# EAGLE design buttons (EAGLE 6.5.0)
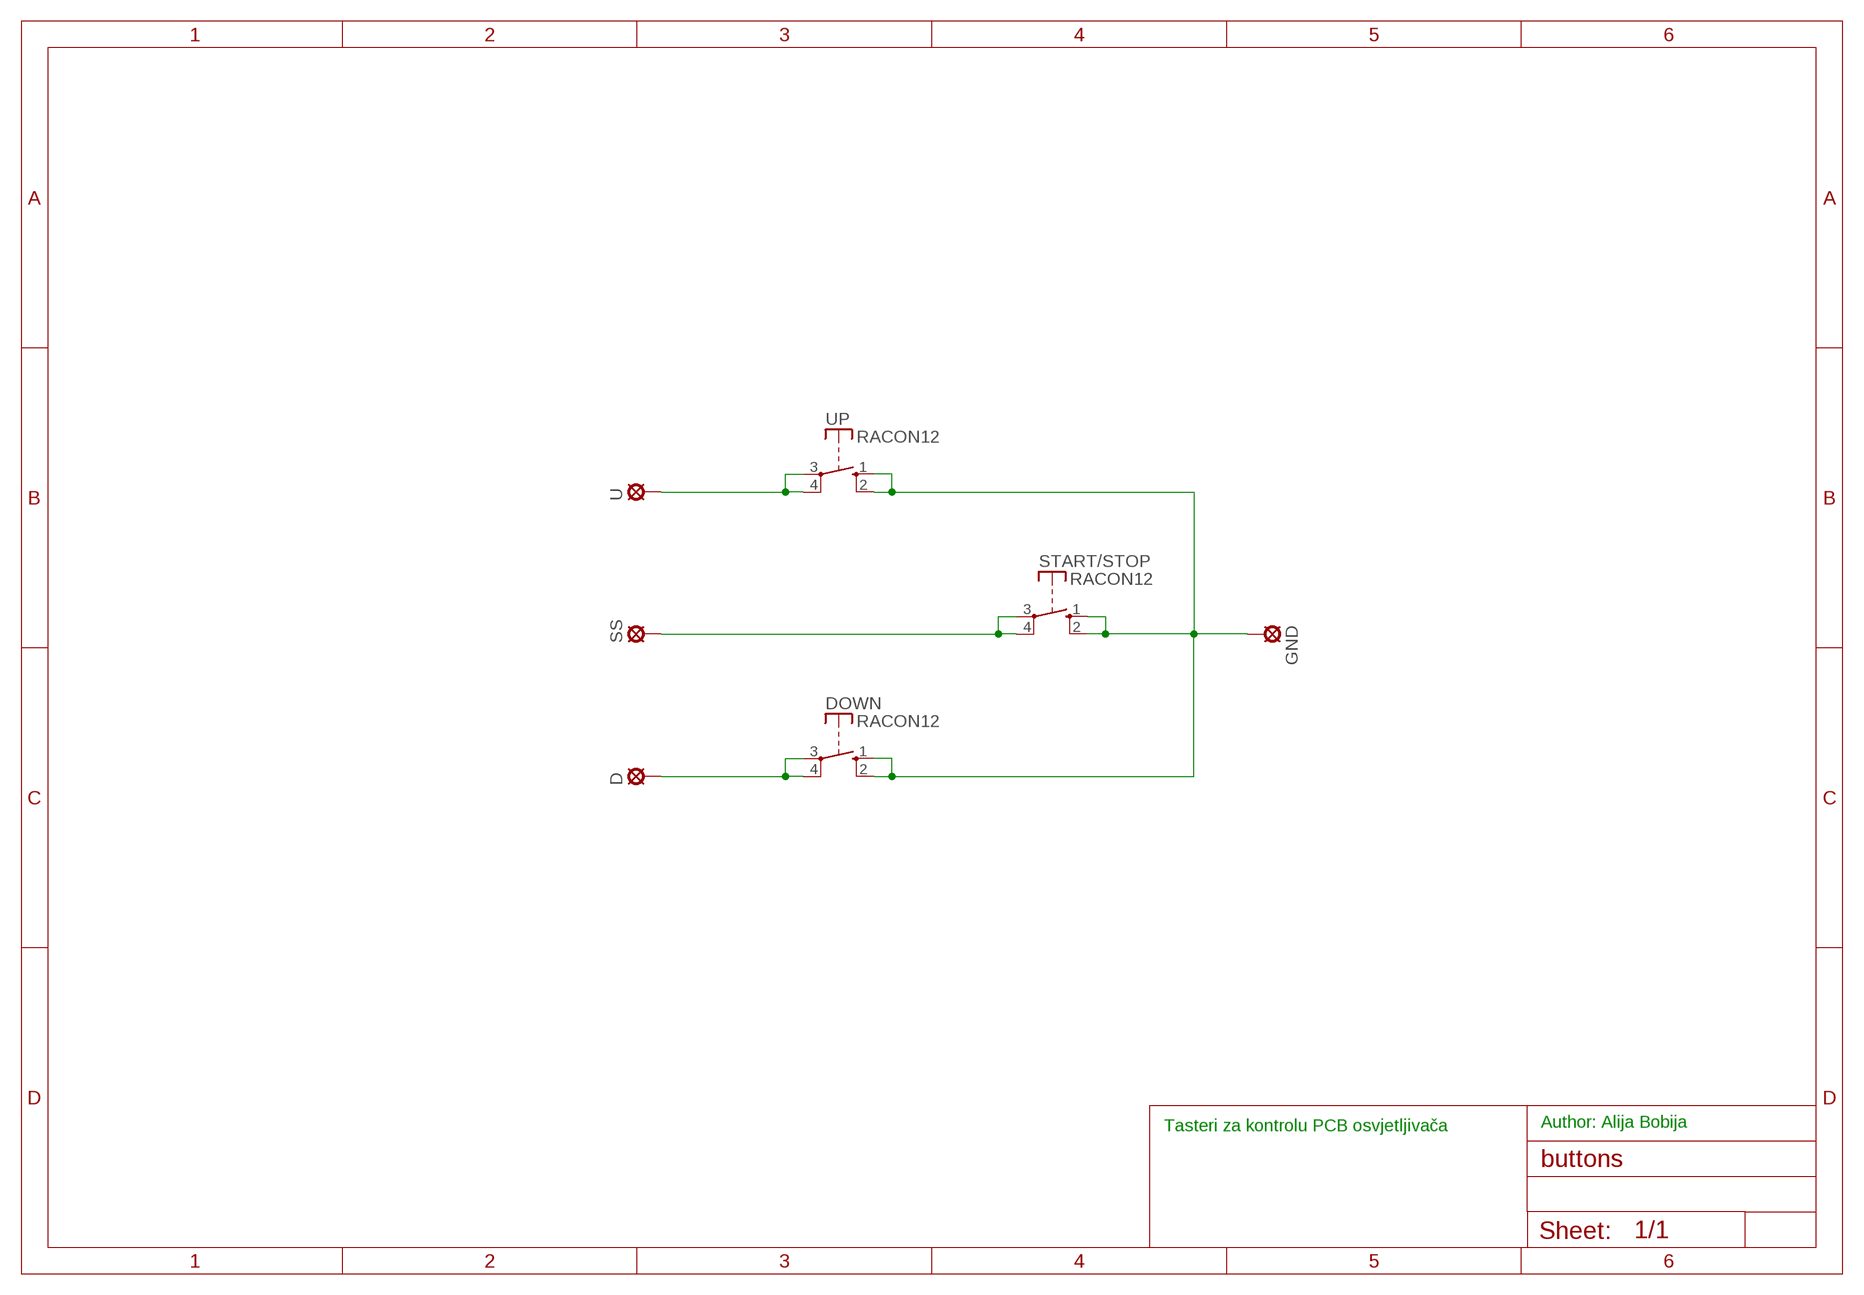
[diagram p0: schematic, sheet 1]

## Parts
D  SE11  [SE11]
DOWN  RACON12  [RACON12]
GND  SE11  [SE11]
SS  SE11  [SE11]
START/STOP  RACON12  [RACON12]
U  SE11  [SE11]
UP  RACON12  [RACON12]

## Nets
N$1: DOWN.1(S) DOWN.2(S) GND.MP START/STOP.1(S) START/STOP.2(S) UP.1(S) UP.2(S)
N$2: U.MP UP.3(P) UP.4(P)
N$3: D.MP DOWN.3(P) DOWN.4(P)
N$5: SS.MP START/STOP.3(P) START/STOP.4(P)

## Notes on the sheet
- Tasteri za kontrolu PCB osvjetljivača | Author: Alija Bobija

## Library data of the parts
D GND SS U = solpad:SE11: SOLDER PAD RTM, drill 1,1mm, distributor Buerklin, 07F810
DOWN START/STOP UP = switch-misc:RACON12: ITT SWITCH

## Board
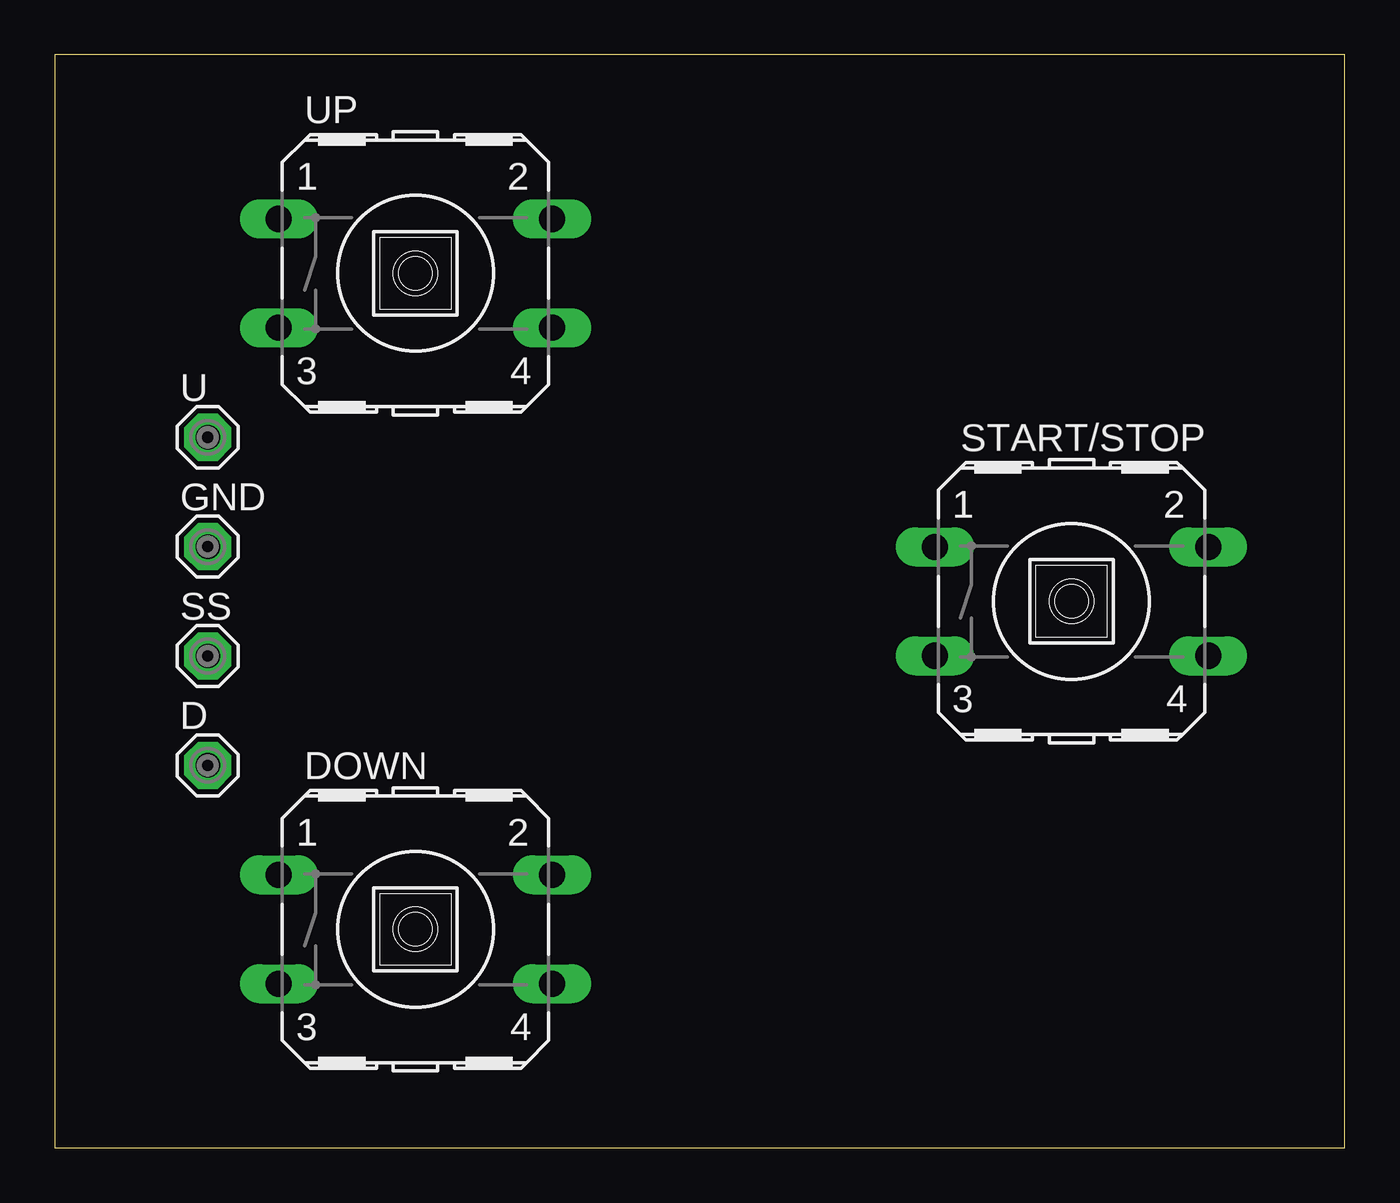
[diagram p1: board, top side]
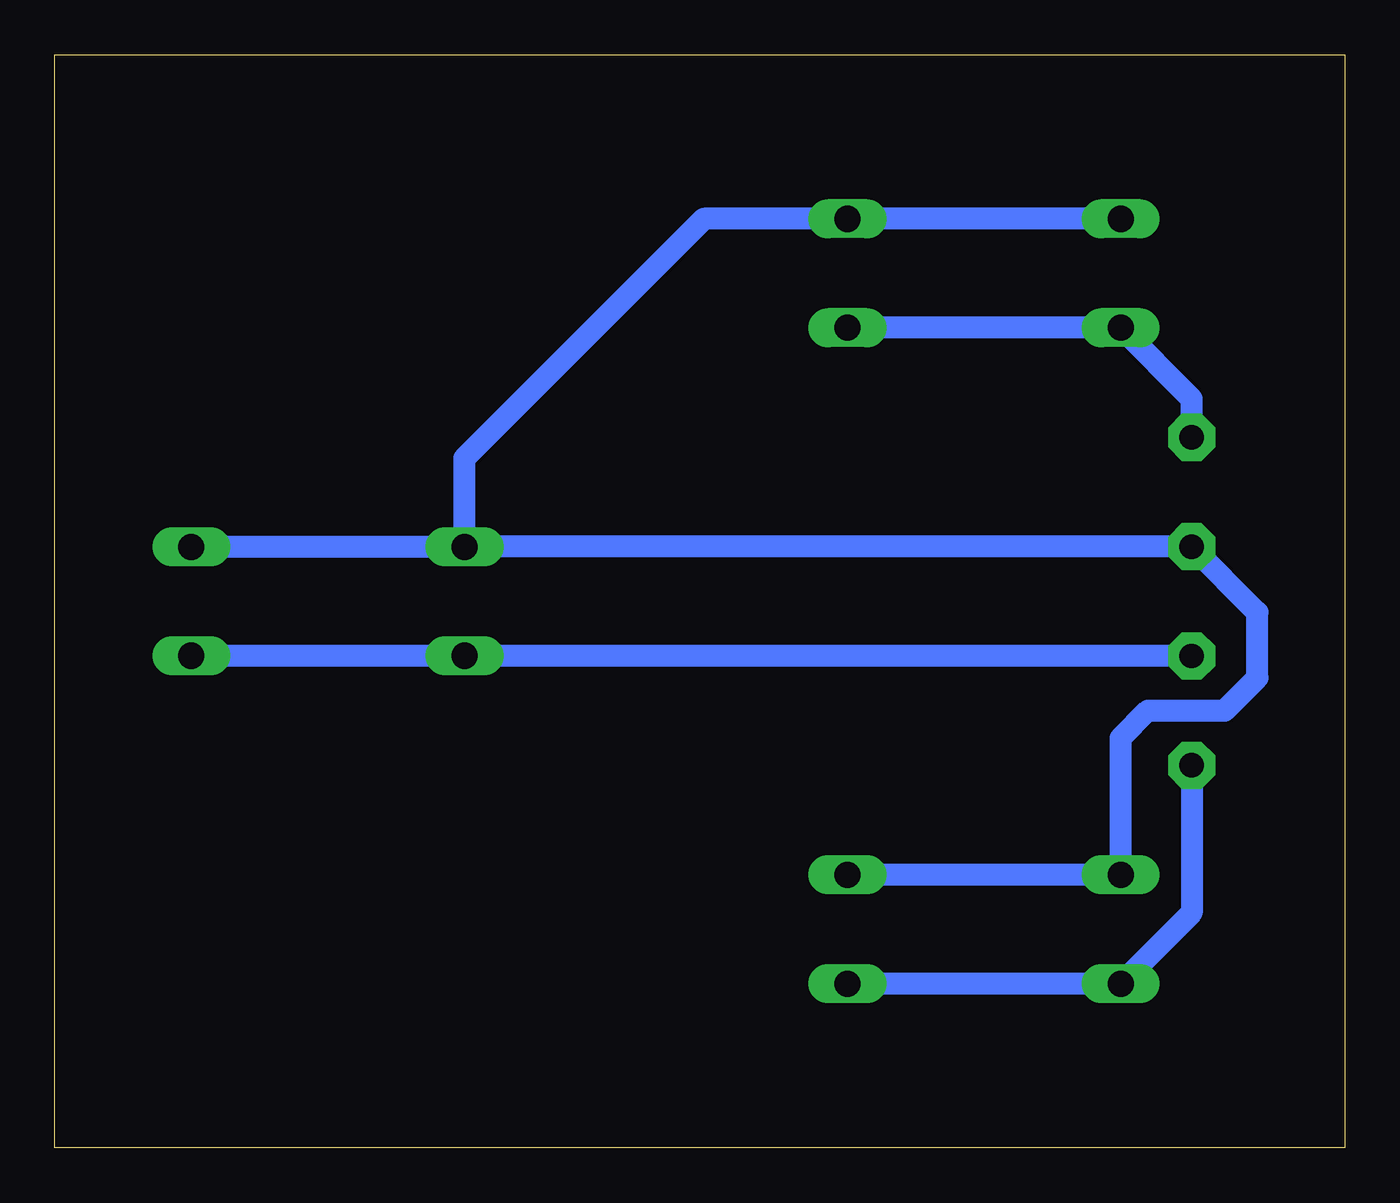
[diagram p2: board, bottom side, seen from below]

Size 59 x 50 mm. Coordinates in mm from the lower left corner, seen from the top.
Outline: 0,0 59,0 59,50 0,50 0,0
Copper layers (1*16): Top 0.035mm / dielectric 1.5mm / Bottom 0.035mm
Design rules "default": minimum track width 10mil, minimum drill 24mil, track to track 8mil, track to pad 8mil, pad to pad 8mil, via to via 8mil, smd to smd 8mil, copper to edge 40mil, drill to drill 8mil, minimum pad ring 10mil, minimum via ring 8mil, stop-mask expansion 4mil, vias tented up to drill 0mil, thermal gap 10mil

### Footprints (pad centres in the part's own frame; a part is rotated, then mirrored left to right if it is on the bottom)
SE11 = drill 1.118 pad 2.159 octagon: MP 0,0
RACON12 = drill 1.194 long: 1 -6.248,2.489; 2 6.248,2.489; 3 -6.248,-2.489; 4 6.248,-2.489

### Placement (x,y rotation side)
D  7,17.5 0 top
DOWN  16.5,10 0 top
GND  7,27.5 0 top
SS  7,22.5 0 top
START/STOP  46.5,25 0 top
U  7,32.5 0 top
UP  16.5,40 0 top

### Tracks (layer width: path | path; a pad name or v marks a point on that pad's centre or on a via)
N$1
  Bottom 1: UP.2 UP.1 29.31,42.49 40.27,31.53 40.27,27.51 START/STOP.1 | DOWN.2 DOWN.1 10.25,18.75 9,20 5.5,20 4,21.5 4,24.5 GND.MP START/STOP.1 | START/STOP.1 START/STOP.2
N$2
  Bottom 1: UP.4 UP.3 7,34.26 U.MP
N$3
  Bottom 1: D.MP 7,10.76 DOWN.3 DOWN.4
N$5
  Bottom 1: SS.MP START/STOP.3 START/STOP.4